# EAGLE schematic airu-board (EAGLE 7.6.0)

## Sheet 1 of 3
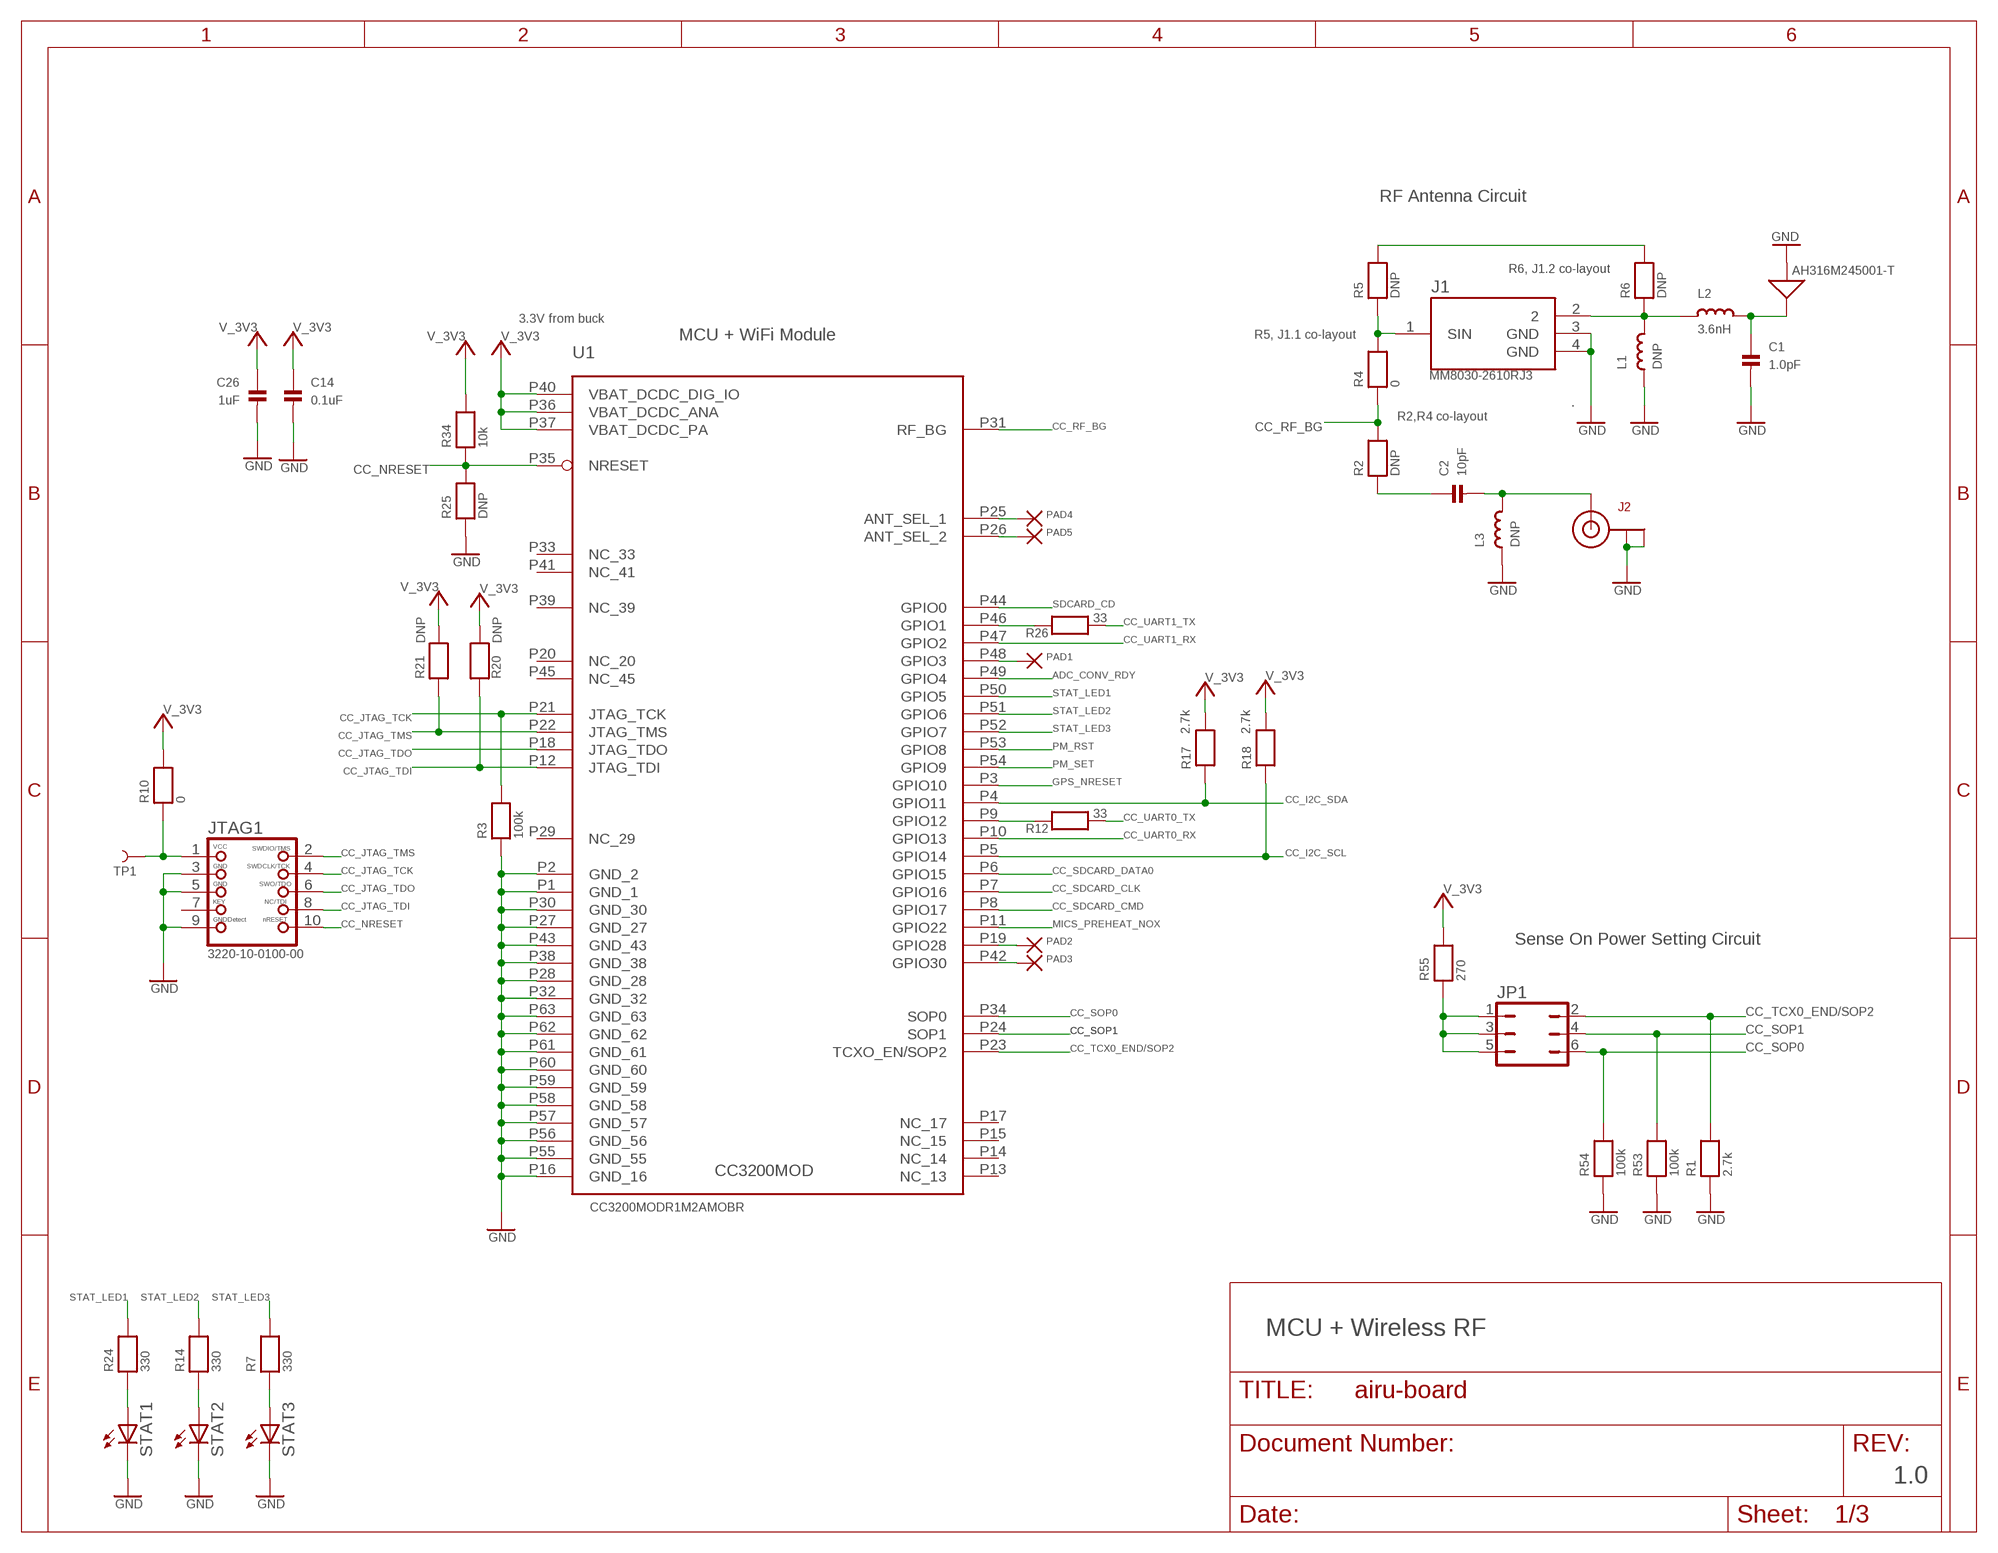
[diagram p0: schematic, sheet 1]

### Parts
C1  1.0pF  CAP_CERAMIC0402  [0402]
C2  10pF  CAP_CERAMIC0402  [0402]
C14  0.1uF  CAP_CERAMIC0402  [0402]
C26  1uF  CAP_CERAMIC0402  [0402]
E1  AH316M245001-T  [AH316M]
J1  MM8030-2610RJ3  [MURATA_MM8030-2610RJ3]
J2  U.FL-R-SMT-1(10)  U.FL  [U.FL]
JP1  JP3Q  [JP3Q]
JTAG1  3220-10-0100-00  JTAG-CORTEXM3MOLEX  [CORTEXM3_SWD10_MOLEX]
L1  DNP  INDUCTOR_0402  [_0402]
L2  3.6nH  INDUCTOR_0402  [_0402]
L3  DNP  INDUCTOR_0402  [_0402]
PAD1  2,54/1,0  [2,54/1,0]
PAD2  2,54/1,0  [2,54/1,0]
PAD3  2,54/1,0  [2,54/1,0]
PAD4  2,54/1,0  [2,54/1,0]
PAD5  2,54/1,0  [2,54/1,0]
R1  2.7k  RESISTOR0402  [0402]
R2  DNP  RESISTOR0402  [0402]
R3  100k  RESISTOR0402  [0402]
R4  0  RESISTOR0402  [0402]
R5  DNP  RESISTOR0402  [0402]
R6  DNP  RESISTOR0402  [0402]
R7  330  RESISTOR0402  [0402]
R10  0  RESISTOR0402  [0402]
R12  33  RESISTOR0402  [0402]
R14  330  RESISTOR0402  [0402]
R17  2.7k  RESISTOR0402  [0402]
R18  2.7k  RESISTOR0402  [0402]
R20  DNP  RESISTOR0402  [0402]
R21  DNP  RESISTOR0402  [0402]
R24  330  RESISTOR0402  [0402]
R25  DNP  RESISTOR0402  [0402]
R26  33  RESISTOR0402  [0402]
R34  10k  RESISTOR0402  [0402]
R53  100k  RESISTOR0402  [0402]
R54  100k  RESISTOR0402  [0402]
R55  270  RESISTOR0402  [0402]
STAT1  LEDCHIPLED_0603  [CHIPLED_0603]
STAT2  LEDCHIPLED_0603  [CHIPLED_0603]
STAT3  LEDCHIPLED_0603  [CHIPLED_0603]
TP1  TEST-POINT2  [PAD.02X.02]
U1  CC3200MODR1M2AMOBR  CC3200MOD  [CC3200MOD]

### Nets
ADC_CONV_RDY: U1.P49(GPIO4) ; also sheet 2
CC_I2C_SCL: R18.1 U1.P5(GPIO14) ; also sheet 2
CC_I2C_SDA: R17.1 U1.P4(GPIO11) ; also sheet 2
CC_JTAG_TCK: JTAG1.4 R3.2 U1.P21(JTAG_TCK)
CC_JTAG_TDI: JTAG1.8 R20.1 U1.P12(JTAG_TDI)
CC_JTAG_TDO: JTAG1.6 U1.P18(JTAG_TDO)
CC_JTAG_TMS: JTAG1.2 R21.1 U1.P22(JTAG_TMS)
CC_NRESET: JTAG1.10 R25.2 R34.1 U1.P35(NRESET) ; also sheet 3
CC_RF_BG: R2.2 R4.1 U1.P31(RF_BG)
CC_SDCARD_CLK: U1.P7(GPIO16) ; also sheet 2
CC_SDCARD_CMD: U1.P8(GPIO17) ; also sheet 2
CC_SDCARD_DATA0: U1.P6(GPIO15) ; also sheet 2
CC_SOP0: JP1.6 R54.2 U1.P34(SOP0)
CC_SOP1: JP1.4 R53.2 U1.P24(SOP1)
CC_TCX0_END/SOP2: JP1.2 R1.2 U1.P23(TCXO_EN/SOP2)
CC_UART0_RX: U1.P10(GPIO13) ; also sheet 2
CC_UART0_TX: R12.2 ; also sheet 2
CC_UART1_RX: U1.P47(GPIO2) ; also sheet 2
CC_UART1_TX: R26.2 ; also sheet 2
GND: C1.2 C14.2 C26.2 E1.P$2 J1.3(GND) J1.4(GND) J2.1(GND) J2.2(GND) JTAG1.3 JTAG1.5 JTAG1.9 L1.1 L3.1 R1.1 R3.1 R25.1 R53.1 R54.1 STAT1.C STAT2.C STAT3.C U1.P1(GND_1) U1.P2(GND_2) U1.P16(GND_16) U1.P27(GND_27) U1.P28(GND_28) U1.P30(GND_30) U1.P32(GND_32) U1.P38(GND_38) U1.P43(GND_43) U1.P55(GND_55) U1.P56(GND_56) U1.P57(GND_57) U1.P58(GND_58) U1.P59(GND_59) U1.P60(GND_60) U1.P61(GND_61) U1.P62(GND_62) U1.P63(GND_63) ; also sheet 2,3
GPS_NRESET: U1.P3(GPIO10) ; also sheet 2
MICS_PREHEAT_NOX: U1.P11(GPIO22) ; also sheet 2
N$1: J1.1(SIN) R4.2 R5.1
N$2: R5.2 R6.2
N$3: J1.2 L1.2 L2.1 R6.1
N$4: C1.1 E1.P$1 L2.2
N$7: C2.1 R2.1
N$8: C2.2 J2.3(SIGNAL) L3.2
N$15: JTAG1.1 R10.1 TP1.P$1
N$20: R12.1 U1.P9(GPIO12)
N$22: R26.1 U1.P46(GPIO1)
N$26: R24.1 STAT1.A
N$27: R14.1 STAT2.A
N$28: R7.1 STAT3.A
N$29: PAD1.1(P) U1.P48(GPIO3)
N$33: PAD2.1(P) U1.P19(GPIO28)
N$34: PAD3.1(P) U1.P42(GPIO30)
N$35: PAD4.1(P) U1.P25(ANT_SEL_1)
N$36: PAD5.1(P) U1.P26(ANT_SEL_2)
N$48: JP1.1 JP1.3 JP1.5 R55.1
PM_RST: U1.P53(GPIO8) ; also sheet 2
PM_SET: U1.P54(GPIO9) ; also sheet 2
SDCARD_CD: U1.P44(GPIO0) ; also sheet 2
STAT_LED1: R24.2 U1.P50(GPIO5)
STAT_LED2: R14.2 U1.P51(GPIO6)
STAT_LED3: R7.2 U1.P52(GPIO7)
V_3V3: C14.1 C26.1 R10.2 R17.2 R18.2 R20.2 R21.2 R34.2 R55.2 U1.P36(VBAT_DCDC_ANA) U1.P37(VBAT_DCDC_PA) U1.P40(VBAT_DCDC_DIG_IO) ; supply symbol labelled VCC ; also sheet 2,3
Unconnected: JTAG1.7 U1.P13(NC_13) U1.P14(NC_14) U1.P15(NC_15) U1.P17(NC_17) U1.P20(NC_20) U1.P29(NC_29) U1.P33(NC_33) U1.P39(NC_39) U1.P41(NC_41) U1.P45(NC_45)

### Notes on the sheet
- RF Antenna Circuit
- R6, J1.2 co-layout
- 3.3V from buck
- R5, J1.1 co-layout
- MCU + WiFi Module
- R2,R4 co-layout
- Sense On Power Setting Circuit
- MCU + Wireless RF
- 1.0

## Sheet 2 of 3
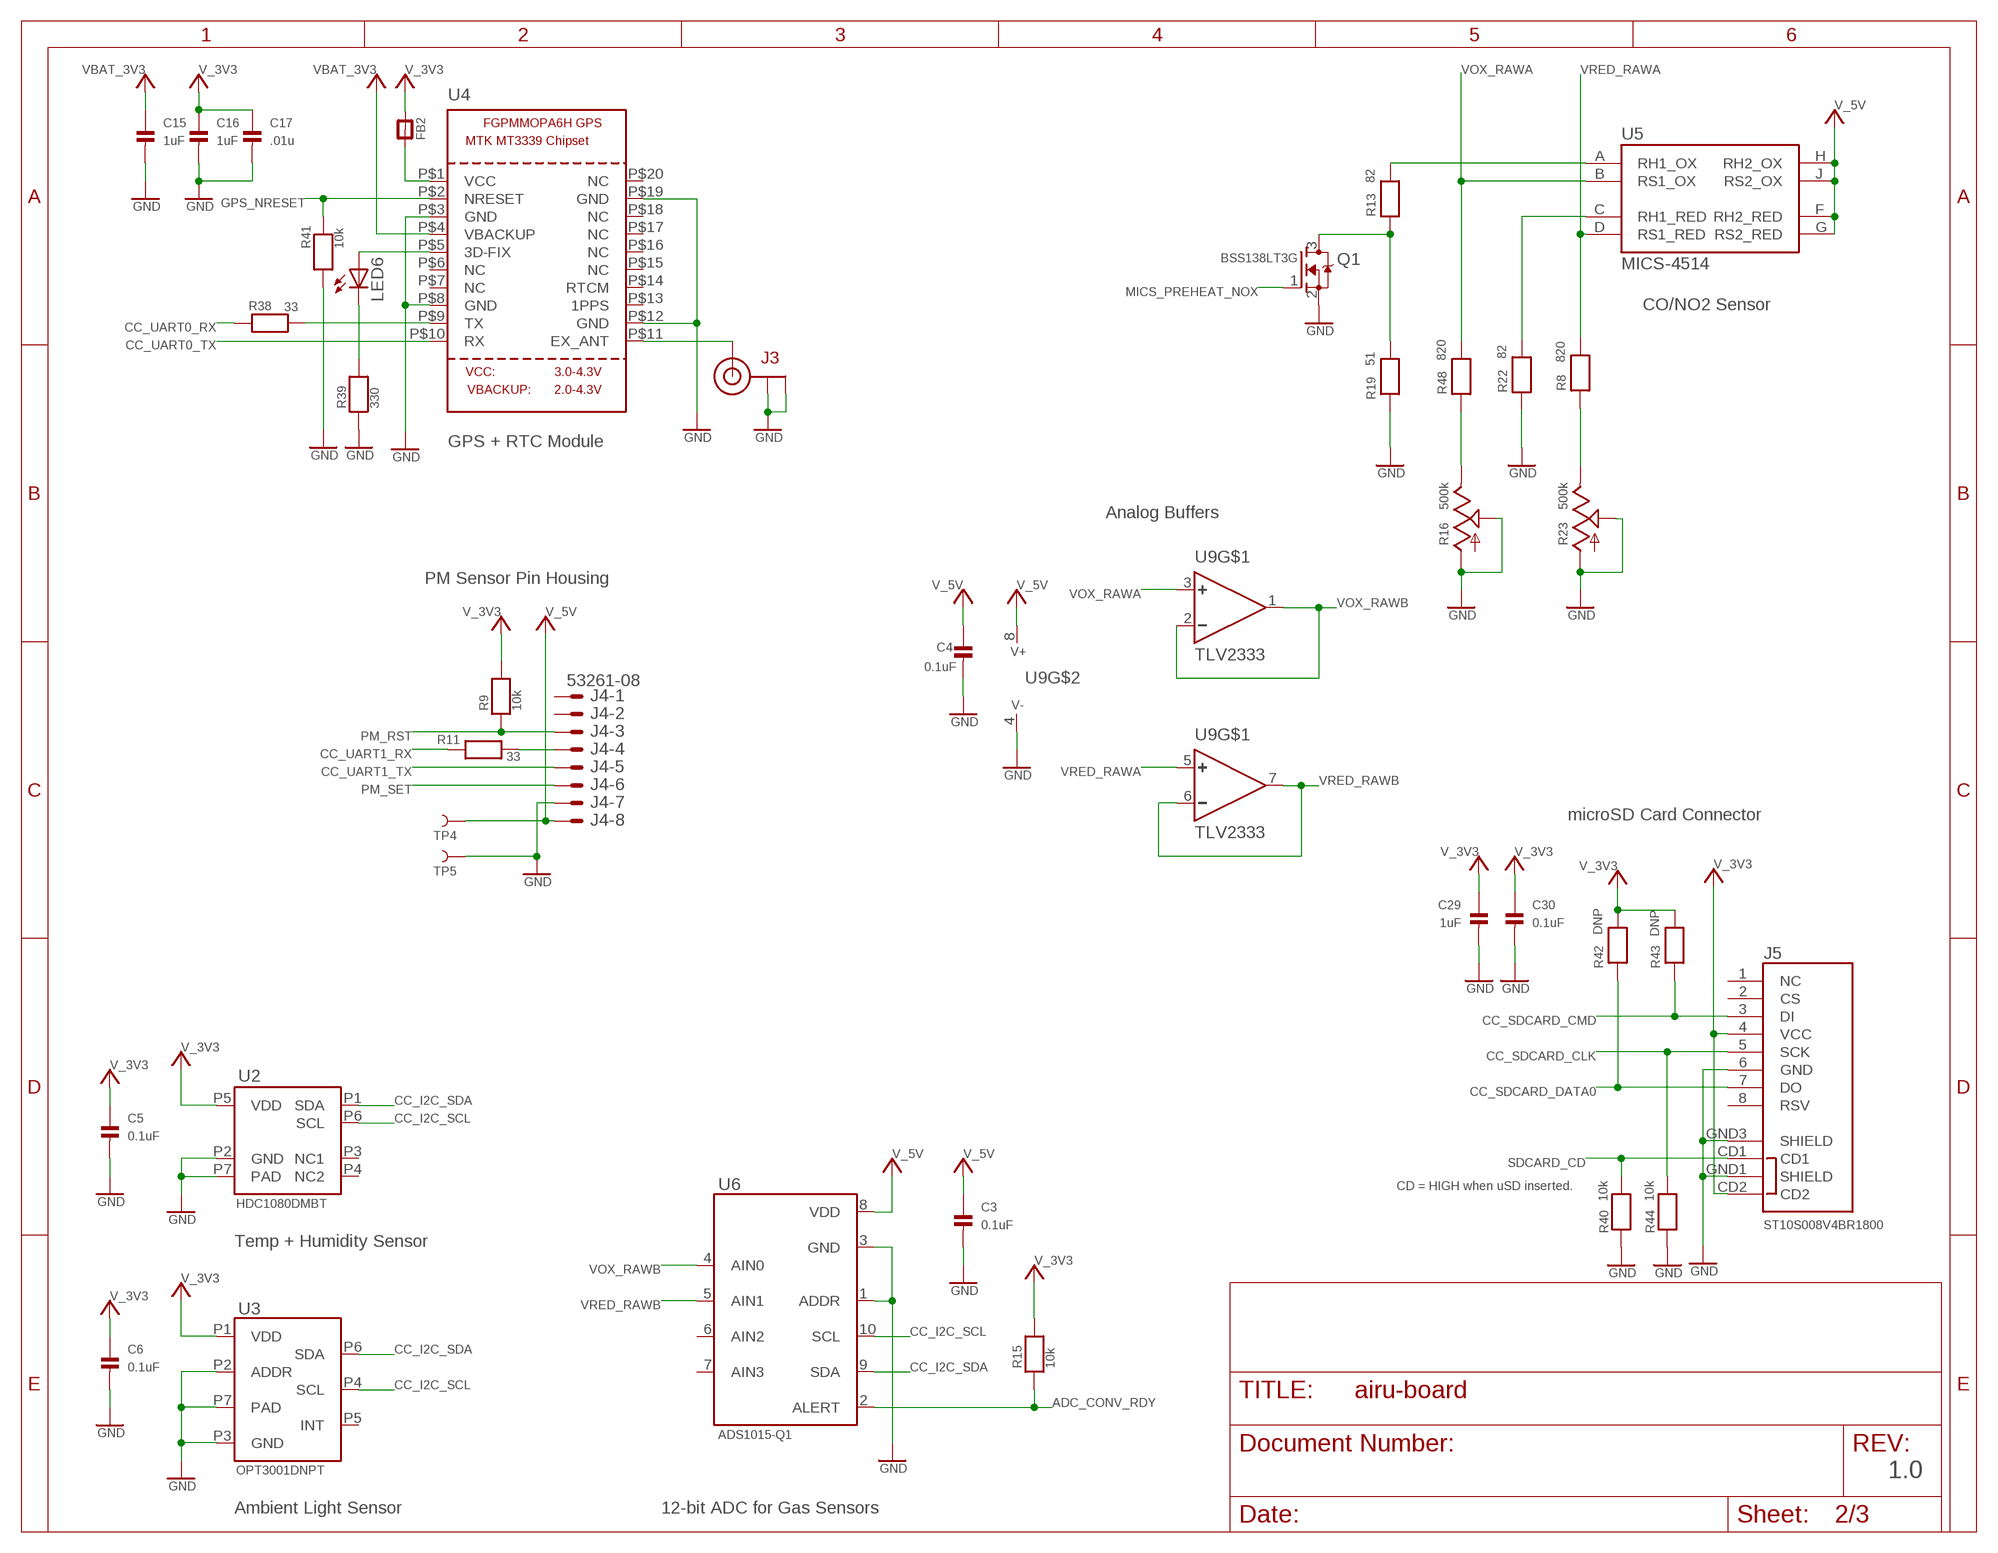
[diagram p1: schematic, sheet 2]

### Parts
C3  0.1uF  CAP_CERAMIC_0402  [_0402]
C4  0.1uF  CAP_CERAMIC_0402  [_0402]
C5  0.1uF  CAP_CERAMIC_0402  [_0402]
C6  0.1uF  CAP_CERAMIC_0402  [_0402]
C15  1uF  CAP_CERAMIC_0402  [_0402]
C16  1uF  CAP_CERAMIC_0402  [_0402]
C17  .01u  CAP_CERAMIC_0402  [_0402]
C29  1uF  CAP_CERAMIC_0402  [_0402]
C30  0.1uF  CAP_CERAMIC_0402  [_0402]
FB2  FERRITE_0402  [_0402]
J3  U.FL-R-SMT-1(10)  U.FL  [U.FL]
J4  53261-08  [53261-08]
J5  ST10S008V4BR1800  USD-SOCKET  [MICROSD_1:1]
LED6  LEDCHIPLED_0603  [CHIPLED_0603]
Q1  BSS138LT3G  MOSFET-NREFLOW  [SOT23]
R8  820  RESISTOR0402  [0402]
R9  10k  RESISTOR0402  [0402]
R11  33  RESISTOR0402  [0402]
R13  82  RESISTOR0402  [0402]
R15  10k  RESISTOR0402  [0402]
R16  500k  TRIM_US-B25P  [B25P]
R19  51  RESISTOR0402  [0402]
R22  82  RESISTOR0402  [0402]
R23  500k  TRIM_US-B25P  [B25P]
R38  33  RESISTOR0402  [0402]
R39  330  RESISTOR0402  [0402]
R40  10k  RESISTOR0402  [0402]
R41  10k  RESISTOR0402  [0402]
R42  DNP  RESISTOR0402  [0402]
R43  DNP  RESISTOR0402  [0402]
R44  10k  RESISTOR0402  [0402]
R48  820  RESISTOR0402  [0402]
TP4  TEST-POINT2  [PAD.02X.02]
TP5  TEST-POINT2  [PAD.02X.02]
U2  HDC1080DMBT  HDC1080  [WSON]
U3  OPT3001DNPT  OPT3001  [USON]
U4  GPS_FGPMMOPA6H  [FGPMMOPA6H]
U5  MICS-4514  [MICS_10-SMD]
U6  ADS1015-Q1  ADS1015  [S-PDSO-G10]
U9  TLV2333  [DGK_S-PDSO-G8]

### Nets
ADC_CONV_RDY: R15.1 U6.2(ALERT) ; also sheet 1
CC_I2C_SCL: U2.P6(SCL) U3.P4(SCL) U6.10(SCL) ; also sheet 1
CC_I2C_SDA: U2.P1(SDA) U3.P6(SDA) U6.9(SDA) ; also sheet 1
CC_SDCARD_CLK: J5.5(SCK) R44.2 ; also sheet 1
CC_SDCARD_CMD: J5.3(DI) R43.1 ; also sheet 1
CC_SDCARD_DATA0: J5.7(DO) R42.1 ; also sheet 1
CC_UART0_RX: R38.1 ; also sheet 1
CC_UART0_TX: U4.P$10(RX) ; also sheet 1
CC_UART1_RX: R11.1 ; also sheet 1
CC_UART1_TX: J4.5 ; also sheet 1
GND: C3.2 C4.2 C5.2 C6.2 C15.2 C16.2 C17.2 C29.2 C30.2 J3.1(GND) J3.2(GND) J4.7 J5.6(GND) J5.GND1(SHIELD) J5.GND3(SHIELD) Q1.2(S) R16.A R16.S R19.1 R22.1 R23.A R23.S R39.1 R40.1 R41.1 R44.1 TP5.P$1 U2.P2(GND) U2.P7(PAD) U3.P2(ADDR) U3.P3(GND) U3.P7(PAD) U4.P$3(GND) U4.P$8(GND) U4.P$12(GND) U4.P$19(GND) U6.1(ADDR) U6.3(GND) U9.4(V-) ; also sheet 1,3
GPS_NRESET: R41.2 U4.P$2(NRESET) ; also sheet 1
MICS_PREHEAT_NOX: Q1.1(G) ; also sheet 1
N$11: J4.4 R11.2
N$13: R13.2 U5.A(RH1_OX)
N$14: Q1.3(D) R13.1 R19.2
N$19: R22.2 U5.C(RH1_RED)
N$21: R16.E R48.1
N$24: R8.1 R23.E
N$30: J3.3(SIGNAL) U4.P$11(EX_ANT)
N$31: LED6.A U4.P$5(3D-FIX)
N$32: LED6.C R39.2
N$44: R38.2 U4.P$9(TX)
PM_RST: J4.3 R9.1 ; also sheet 1
PM_SET: J4.6 ; also sheet 1
SDCARD_CD: J5.CD1 R40.2 ; also sheet 1
V_3V3: C5.1 C6.1 C16.1 C17.1 C29.1 C30.1 FB2.1 FB2.2 J5.4(VCC) J5.CD2 R9.2 R15.2 R42.2 R43.2 U2.P5(VDD) U3.P1(VDD) U4.P$1(VCC) ; supply symbol labelled VCC ; also sheet 1,3
V_5V: C3.1 C4.1 J4.8 TP4.P$1 U5.F(RH2_RED) U5.G(RS2_RED) U5.H(RH2_OX) U5.J(RS2_OX) U6.8(VDD) U9.8(V+) ; supply symbol labelled VCC ; also sheet 3
VBAT_3V3: C15.1 U4.P$4(VBACKUP) ; supply symbol labelled VCC ; also sheet 3
VOX_RAWA: R48.2 U5.B(RS1_OX) U9.3(+)
VOX_RAWB: U6.4(AIN0) U9.1(OUT) U9.2(-)
VRED_RAWA: R8.2 U5.D(RS1_RED) U9.5(+1)
VRED_RAWB: U6.5(AIN1) U9.6(-1) U9.7(OUT1)
Unconnected: J4.1 J4.2 J5.1(NC) J5.2(CS) J5.8(RSV) U2.P3(NC1) U2.P4(NC2) U3.P5(INT) U4.P$6(NC) U4.P$7(NC) U4.P$13(1PPS) U4.P$14(RTCM) U4.P$15(NC) U4.P$16(NC) U4.P$17(NC) U4.P$18(NC) U4.P$20(NC) U6.6(AIN2) U6.7(AIN3)

### Notes on the sheet
- CO/NO2 Sensor
- GPS + RTC Module
- Analog Buffers
- PM Sensor Pin Housing
- microSD Card Connector
- CD = HIGH when uSD inserted.
- Temp + Humidity Sensor
- 1.0
- Ambient Light Sensor | 12-bit ADC for Gas Sensors

## Sheet 3 of 3
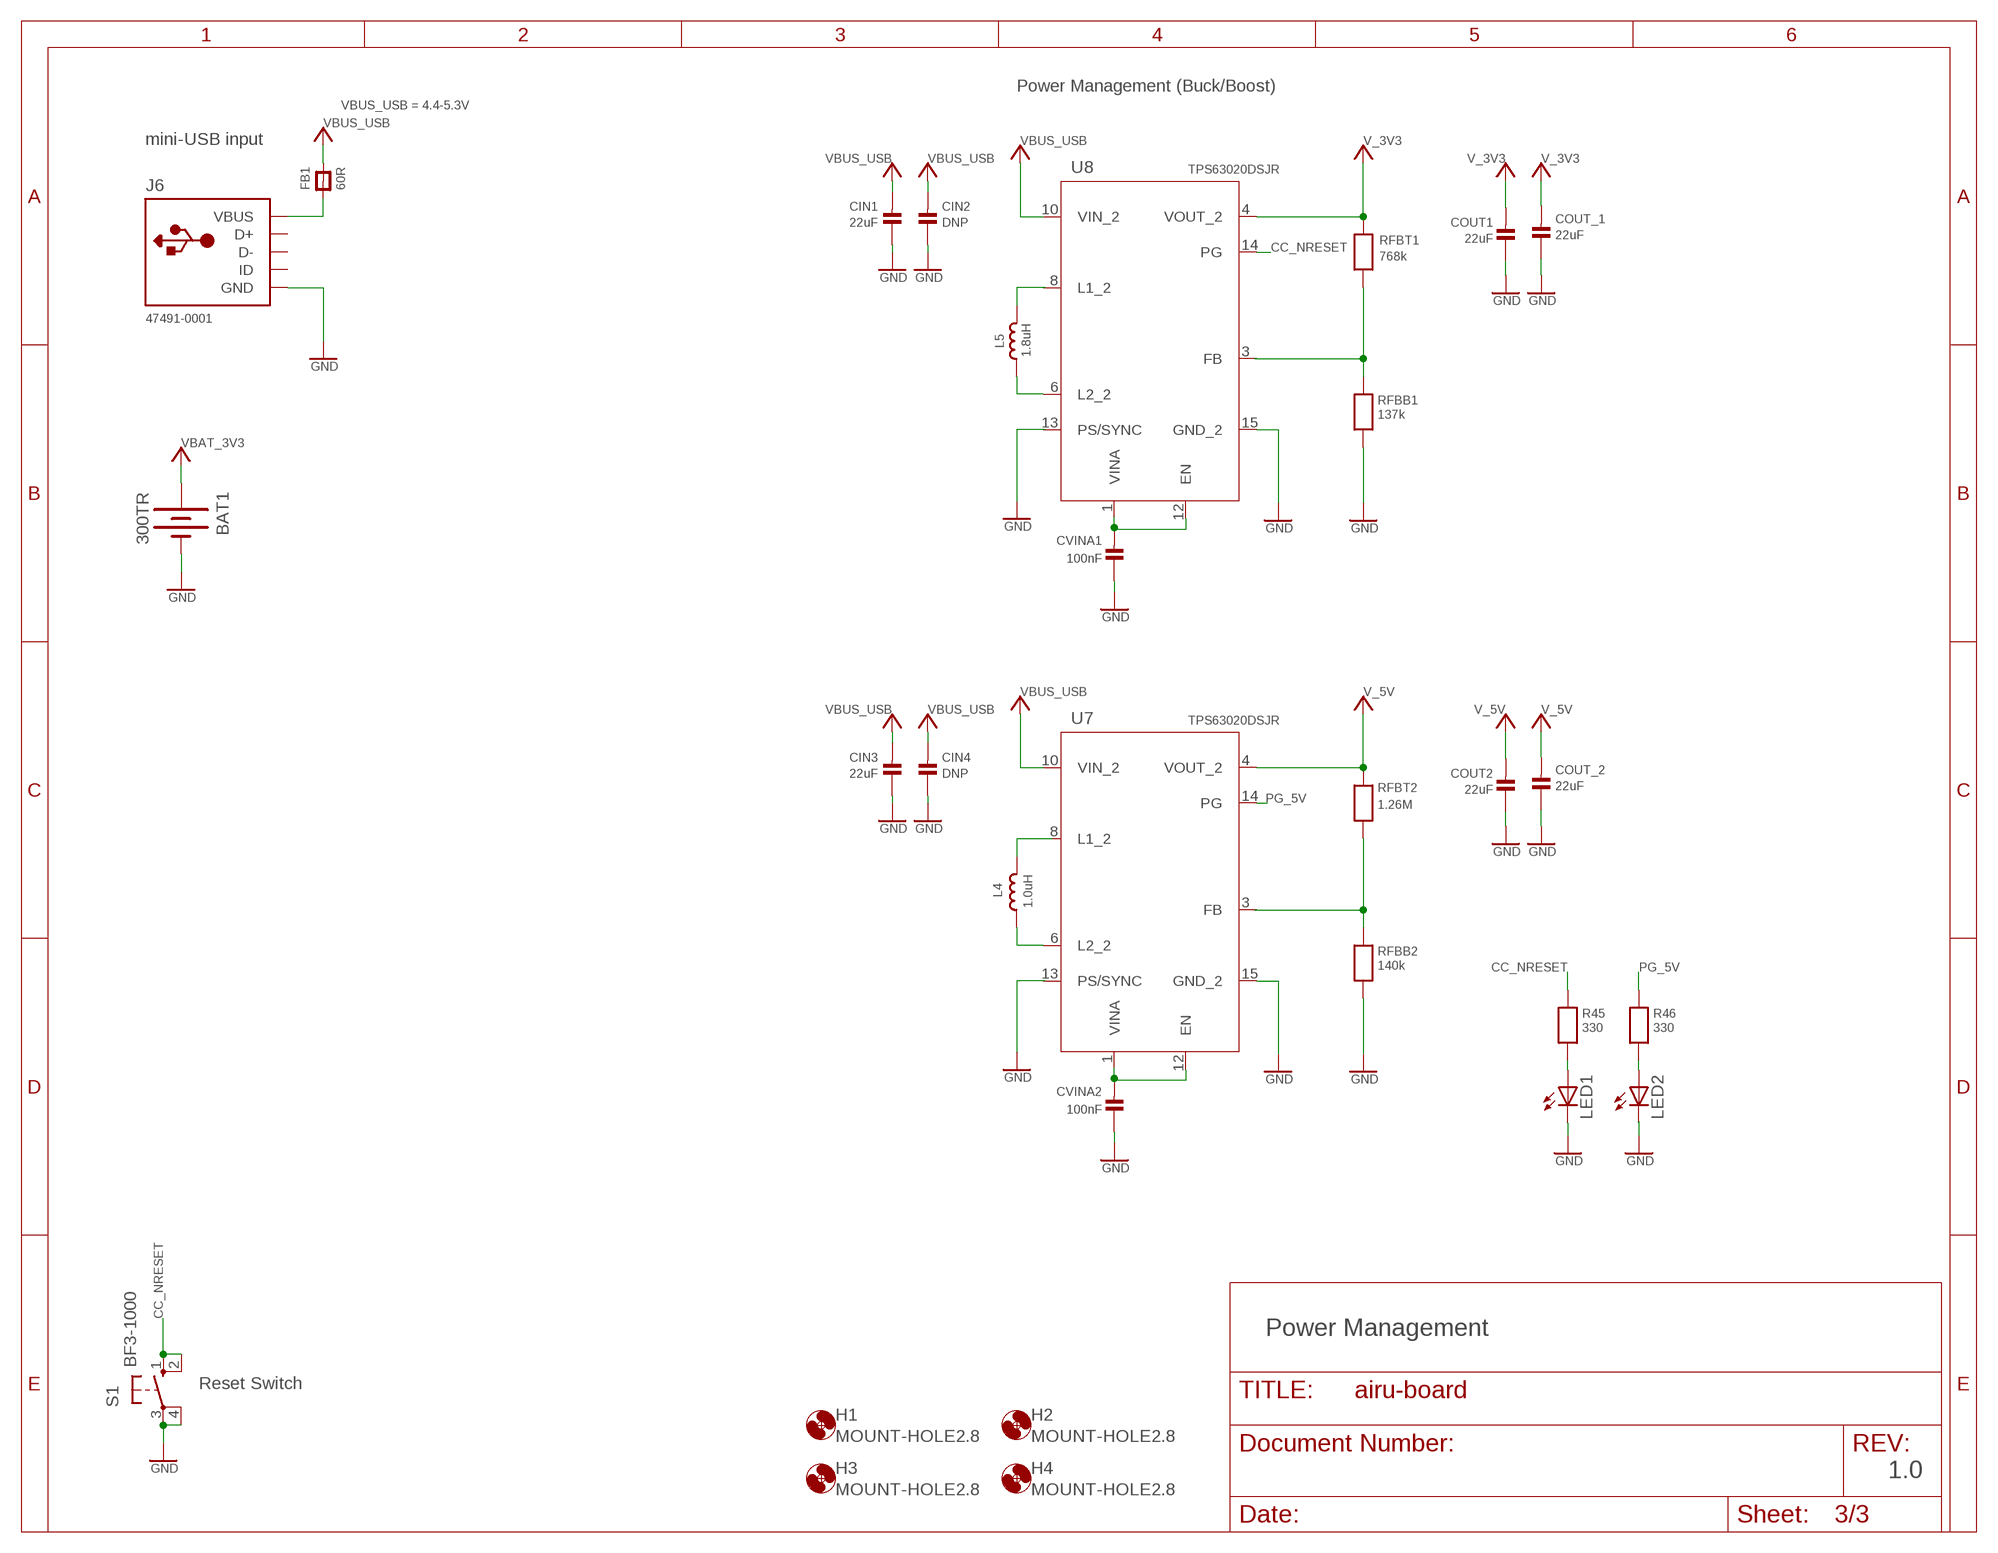
[diagram p2: schematic, sheet 3]

### Parts
BAT1  300TR  BATTERY12MM  [BATTCON_12MM]
CIN1  22uF  GRM31CR61A226KE19L  [1206_190]
CIN2  DNP  GRM31CR61A226KE19L  [1206_190]
CIN3  22uF  GRM31CR61A226KE19L  [1206_190]
CIN4  DNP  GRM31CR61A226KE19L  [1206_190]
COUT1  22uF  GRM21BR60J226ME39L  [0805]
COUT2  22uF  GRM21BR60J226ME39L  [0805]
COUT_1  22uF  GRM21BR60J226ME39L  [0805]
COUT_2  22uF  GRM21BR60J226ME39L  [0805]
CVINA1  100nF  C0603C104K8RACTU  [0603]
CVINA2  100nF  C0603C104K8RACTU  [0603]
FB1  60R  FERRITE_0402  [_0402]
H1  MOUNT-HOLE2.8  [2,8]
H2  MOUNT-HOLE2.8  [2,8]
H3  MOUNT-HOLE2.8  [2,8]
H4  MOUNT-HOLE2.8  [2,8]
J6  47491-0001  USBMINIB  [USB-MINIB]
L4  1.0uH  SRN3015-1R0Y  [SRN3015]
L5  1.8uH  SDR0403-1R8ML  [SDR0403]
LED1  LEDCHIPLED_0603  [CHIPLED_0603]
LED2  LEDCHIPLED_0603  [CHIPLED_0603]
R45  330  CRCW0402137KFKED  [0402]
R46  330  CRCW0402137KFKED  [0402]
RFBB1  137k  CRCW0402137KFKED  [0402]
RFBB2  140k  CRCW0402137KFKED  [0402]
RFBT1  768k  CRCW0402768KFKED  [0402]
RFBT2  1.26M  RT0805BRD071M26L  [0805]
S1  BF3-1000  10-XX  [B3F-10XX]
U7  TPS63020DSJR  [R-PVSON-N14]
U8  TPS63020DSJR  [R-PVSON-N14]

### Nets
CC_NRESET: R45.P1 S1.1(S) S1.2(S1) U8.14(PG) ; also sheet 1
GND: BAT1.GND(-) CIN1.2 CIN2.2 CIN3.2 CIN4.2 COUT1.2 COUT2.2 COUT_1.2 COUT_2.2 CVINA1.2 CVINA2.2 J6.GND LED1.C RFBB1.P2 RFBB2.P2 S1.3(P) S1.4(P1) U7.15(GND_2) U8.15(GND_2) ; also sheet 1,2
N$5: CVINA1.1 U8.12(EN)
N$6: L5.2
N$9: L5.1 U8.6(L2_2)
N$10: L4.1 U7.6(L2_2)
N$12: L4.2
N$16: RFBB1.P1 RFBT1.P2
N$17: RFBB2.P1 RFBT2.2
N$18: CVINA2.1 U7.12(EN)
N$23: LED2.A R46.P2
N$25: LED1.A R45.P2
N$39: FB1.1 J6.VBUS
PG_5V: R46.P1 U7.14(PG)
V_3V3: COUT1.1 COUT_1.1 RFBT1.P1 U8.4(VOUT_2) ; supply symbol labelled VCC ; also sheet 1,2
V_5V: COUT2.1 COUT_2.1 RFBT2.1 U7.4(VOUT_2) ; supply symbol labelled VCC ; also sheet 2
VBAT_3V3: BAT1.PWR@1(+) ; supply symbol labelled VCC ; also sheet 2
VBUS_USB: CIN1.1 CIN2.1 CIN3.1 CIN4.1 FB1.2 U7.10(VIN_2) U8.10(VIN_2) ; supply symbol labelled VCC
Unconnected: J6.D+ J6.D- J6.ID LED2.C U7.1(VINA) U7.3(FB) U7.8(L1_2) U7.13(PS/SYNC) U8.1(VINA) U8.3(FB) U8.8(L1_2) U8.13(PS/SYNC)

### Notes on the sheet
- Power Management (Buck/Boost)
- VBUS_USB = 4.4-5.3V
- mini-USB input
- Power Management
- Reset Switch
- 1.0

## Library data of the parts
BAT1 = airu-parts:BATTERY: Battery Holders Various common sizes : AA, AAA, 18650 (PRT-12895), 20mm coin cell and 12mm coin cell. 20MM_4LEGS, BATT-10373; MANUFACTURER_NAME: Keystone; MANUFACTURER_PART_NUMBER: 300TR; PROD_ID: BATT-08044
C1-C6 C14-C17 C26 C29 C30 = microbuilder:CAP_CERAMIC: Ceramic Capacitors 0402 - 0402 Surface Mount Capacitors 16pF 50V 5% [Digikey: 445-4899-2-ND] 18pF 50V 5% [Digikey: 490-1281-2-ND] 22pF 50V 5% [Digikey: 490-1283-2-ND] 68pF 50V 5% [Digikey: 490-1289-2-ND] 0.1uF 10V 10% [Digikey: 490-1318-2-ND] 1.0uF 6.3V 10% [Digikey: 490-1320-2-ND] 0603 - 0603 Surface Mount Capacitors 16 pF 50V 5% [Digikey: 445-5051-2-ND] 22 pF 50V [Digikey: PCC220ACVTR-ND] 33 pF 50V 5% [Digikey: 490-1415-1-ND] 56pF 50V 5% [Digikey: 490-1421-1-ND] 220pF 50V 5% [Digikey: 445-1285-1-ND] 680 pF 50V 2200 pF 50V 5% C0G [Digikey: 445-1297-1-ND] 5600 pF 100V 5% X7R [Digikey: 478-3711-1-ND] 0.1 µF 25V 10% [Digikey: PCC2277TR-ND] 0.22 µF 16V 10% X7R [Digikey: 445-1318-1-ND] 1.0 µF 25V 10% [Digikey: 445-5146-2-ND] 0603 - RF Specific 3pF 250V +/-0.1pF RF [Digikey: 712-1347-1-ND] 18 pF 250V 5% [Digikey: 478-3505-1-ND or 712-1322-1-ND] 56 pF 250V 5% C0G RF [Digikey: 490-4867-1-ND] 68 pF 250V RF [Digikey: 490-4868-1-ND] 0805 - 0805 Surface Mount Capacitors 220 pF 250V 2% RF Ceramic Capacitor [Digikey: 712-1398-1-ND] 1000 pF 50V 2% NP0 Ceramic Capacitor [Digikey: 478-3760-1-ND] 0.1 µF 25V 10% Ceramic Capacitor [Digikey: PCC1828TR-ND] 1.0 µF 16V 10% Ceramic Capacitor[Digikey: 490-1691-2-ND] 10.0 µF 10V 10% Ceramic Capacitor[Digikey: 709-1228-1-ND] 10.0 uF 16V 10% Ceramic Capacitor [Digikey: 478-5165-2-ND] 47 uF 6.3V 20% Ceramic Capacitor [Digikey: 587-1779-1-ND or 399-5506-1-ND] 1206 - 1206 Surface Mount Capacitors 47uF 10V 20% Ceramic Capacitor [Digikey: 490-5528-1-ND or 399-5508-1-ND or 445-6010-1-ND] 100uF 6.3V -20%, +80% Y5V Ceramic Capacitor (Digikey: 490-4512-1-ND, Mouser: 81-GRM31CF50J107ZE1L)
CIN1-CIN4 = AcceleratedDesigns_Lib:GRM31CR61A226KE19L; CAP: 2.2E-5; ESR: 0.0; IRMS: 0.0; MANUFACTURER_NAME: MuRata; MANUFACTURER_PART_NUMBER: GRM31CR61A226KE19L; VDC: 10.0; VENDOR: MuRata
COUT1 COUT2 COUT_1 COUT_2 = AcceleratedDesigns_Lib:GRM21BR60J226ME39L; CAP: 2.2E-5; ESR: 0.0; IRMS: 0.0; MANUFACTURER_NAME: MuRata; MANUFACTURER_PART_NUMBER: GRM21BR60J226ME39L; VDC: 6.3; VENDOR: MuRata
CVINA1 CVINA2 = AcceleratedDesigns_Lib:C0603C104K8RACTU; CAP: 1.0E-7; ESR: 0.0; IRMS: 0.0; MANUFACTURER_NAME: Kemet; MANUFACTURER_PART_NUMBER: C0603C104K8RACTU; VDC: 10.0; VENDOR: Kemet
E1 = yuden:AH316M245001-T: ANT BLUETOOTH W-LAN ZIGBEE WIMAX
FB1 FB2 = microbuilder:FERRITE: Ferrite Bead 0603 MMZ1608B121C - 120 Ohm @ 100MHz, 600mA, 0.15 Ohm DC Resistance - Digikey: 445-2164-1-ND BK1608HW121-T - 120 Ohm, 600mA Ferrite Chip - Digikey: 587-1876-2-ND 0805 HZ0805B272R-10 - 2.7K Ohm @ 100MHz, 200mA, 0.8 Ohm DC Resistance - Digikey: 240-2504-1-ND (see also Murata BLM21BD272SN1L) MMZ2012Y152B - 1.5K Ohm @ 100MHz, 500mA, 0.4 Ohm DC Resistance - Digikey: 445-1560-1-ND - Mainly for high frequency (80-400MHz) MMZ2012R102A - 1K Ohm @ 100MHz, 500mA, 0.3 Ohm DC Resistance - Digikey: 445-1555-2-ND - More general purpose (10-200MHz)
H1-H4 = holes:MOUNT-HOLE: MOUNTING HOLE with drill center marker
J1 = MM8030-2610RJ3:MM8030-2610RJ3: Conn Coaxial RCP 0Hz to 11GHz 50Ohm Solder ST SMD Gold Reel
J2 J3 = microbuilder:U.FL: U.FL Antenna Connector
J4 = con-molex:53?-08: CONNECTOR wire to board 1.25 mm (.049 inch) pitch header; OC_FARNELL: 1125376; OC_NEWARK: unknown
J5 = SparkFun-Connectors:USD-SOCKET: microSD Socket Push-push type uSD socket. Schematic element and footprint production proven. Spark Fun Electronics SKU : PRT-00127. tDoc lines correctly indicate media card edge positions when inserting (unlocked, locked, depressed). NOTE: CD1 and CD2 are connected internally; MANUFACTURER_NAME: JAE; MANUFACTURER_PART_NUMBER: ST10S008V4BR1800; PROD_ID: CONN-07820
J6 = airu-parts:USB: USB Connectors USBMINIB - Surface Mount Female Mini-B USB Connector 4UConnector: 06564 By microbuilder.eu Thru-hole RA Female Mini-B USB Connector 4UConnector: 18732 By ladyada.net; MANUFACTURER_NAME: Molex; MANUFACTURER_PART_NUMBER: 47491-0001
JP1 = jumper:JP3Q: JUMPER
JTAG1 = microbuilder:JTAG-CORTEXM3: Serial Wire (SW-DP) Connector This standard 0.05" 10-pin connector is for use with the Cortex M0/M3's native SWD (serial wire debugger) interface (SW-DP). Some boards support a 20-pin combined JTAG+SWD connector (SWJ-DP), such as the LPC1700 family, but many smaller devices only work with SWD which typically use the smaller 10-pin SW-DP connecter (the LPC1300 family, for example, only supports SWD). 2x05 1.27mm/0.05" Connector: This is the standard SMT connector defined by ARM for all Cortex devices, and should be used in most situations and for forward-compatibility since any new devices coming to market will likely use this connector. MOLEX 10 Pin 0.1" Connector: This 0.1" 10 pin connector has the same pin layout as the standard 0.05" connector, but is easier to work with if you are using standard jumper wires or custom cables to connect your SWD hardware. MOLEX 20 Pin 0.1" Connector: This 0.1" 20 pin connector is the same model used for ARM7/ARM9 JTAG debuggers, but is connected to match the pins on the Segger J-Link for ARM (which supports both JTAG and SWD debugging). See the following document from ARM for more information on Cortex M3 Debug Connectors: http://infocenter.arm.com/help/topic/com.arm.doc.faqs/attached/13634/cortex_debug_connectors.pdf And the following page for an overview with images of the different connector types: http://www.keil.com/peripherals/coresight/connectors.asp; MANUFACTURER_NAME: CNC Tech; MANUFACTURER_PART_NUMBER: 3220-10-0100-00
L1-L3 = microbuilder:INDUCTOR: Inductors 0603: 10nH Ceramic Inductor - microwire antenna/RF (Digikey: 712-1434-2-ND) 0805: 560nH Ceramic Inductor - RF (Digikey: 553-1047-1-ND) 270nH Ceramic Inductor - Q = 40@250MHz, +-5%, 1 Ohm DC Resistance (Digikey: 535-10506-2-ND) 1007 (2518 Metric) SMT: 10µH 10% 250mOhm 820mA 1007 Inductor (Digikey: 587-2189-1-ND) 22µH 10% 500mOhm 580mA 1007 Inductor (Digikey: 587-2190-1-ND) 47µH 10% 950mOhm 420mA 1007 Inductor (Digikey: 587-2191-1-ND) 47µH 5% 100mOhm 1A 1008 Inductor (Digikey: 732-1816-1-ND) 5.0x5.0mm (Taiyo Yuden NR5040 Series) 6.8µH 20% 2.3A 64mOhm Inductor (Digikey: 587-2374-2-ND) 5.0x5.0mm (TDK VLC5045 Series) 4.7µH 20% 3.3A 34mOhm Inductor (Digikey: 445-6526-1-ND) 6.8µH 20% 2.7A 46mOhm Inductor (Digikey: 445-6527-1-ND) 6.0x6.0mm (TDK VLC6045 Series) 4.7µH 20% 3.8A 27mOhm Inductor (Digikey: 445-6538-2-ND) 6.8µH 20% 3A 41mOhm Inductor (Digikey: 445-6540-1-ND) 6.2µH 30% 2.2A 45mOhm Inductor (Digikey: SRR5028-6R2YCT-ND) - Not TDK VLC6045 but footprint should match 6.0x6.0mm (TDK SLF6045 Series) 6.8uH 30% 2A 33mOhm Inductor (Digikey: 445-4572-1-ND, Mouser: 810-SLF645T6R8N2R0PF)
L4 = AcceleratedDesigns_Lib:SRN3015-1R0Y; DATASHEETURL: http://www.bourns.com/data/global/pdfs/SRN3015.pdf; DCR: 0.048; IDC: 2.35; L: 1.0E-6; MANUFACTURER_NAME: Bourns; MANUFACTURER_PART_NUMBER: SRN3015-1R0Y; VENDOR: Bourns
L5 = AcceleratedDesigns_Lib:SDR0403-1R8ML; DCR: 0.042; IDC: 2.91; L: 1.8E-6; MANUFACTURER_NAME: Bourns; MANUFACTURER_PART_NUMBER: SDR0403-1R8ML; VENDOR: Bourns
LED1 LED2 LED6 STAT1-STAT3 = led:LED: LED OSRAM: - CHIPLED LG R971, LG N971, LY N971, LG Q971, LY Q971, LO R971, LY R971 LH N974, LH R974 LS Q976, LO Q976, LY Q976 LO Q996 - Hyper CHIPLED LW Q18S LB Q993, LB Q99A, LB R99A - SideLED LS A670, LO A670, LY A670, LG A670, LP A670 LB A673, LV A673, LT A673, LW A673 LH A674 LY A675 LS A676, LA A676, LO A676, LY A676, LW A676 LS A679, LY A679, LG A679 - Hyper Micro SIDELED® LS Y876, LA Y876, LO Y876, LY Y876 LT Y87S - SmartLED LW L88C, LW L88S LB L89C, LB L89S, LG L890 LS L89K, LO L89K, LY L89K LS L896, LA L896, LO L896, LY L896 - TOPLED LS T670, LO T670, LY T670, LG T670, LP T670 LSG T670, LSP T670, LSY T670, LOP T670, LYG T670 LG T671, LOG T671, LSG T671 LB T673, LV T673, LT T673, LW T673 LH T674 LS T676, LA T676, LO T676, LY T676, LB T676, LH T676, LSB T676, LW T676 LB T67C, LV T67C, LT T67C, LS T67K, LO T67K, LY T67K, LW E67C LS E67B, LA E67B, LO E67B, LY E67B, LB E67C, LV E67C, LT E67C LW T67C LS T679, LY T679, LG T679 LS T770, LO T770, LY T770, LG T770, LP T770 LB T773, LV T773, LT T773, LW T773 LH T774 LS E675, LA E675, LY E675, LS T675 LS T776, LA T776, LO T776, LY T776, LB T776 LHGB T686 LT T68C, LB T68C - Hyper Mini TOPLED® LB M676 - Mini TOPLED Santana® LG M470 LS M47K, LO M47K, LY M47K Source: http://www.osram.convergy.de LUXEON: - LUMILED® LXK2-PW12-R00, LXK2-PW12-S00, LXK2-PW14-U00, LXK2-PW14-V00 LXK2-PM12-R00, LXK2-PM12-S00, LXK2-PM14-U00 LXK2-PE12-Q00, LXK2-PE12-R00, LXK2-PE12-S00, LXK2-PE14-T00, LXK2-PE14-U00 LXK2-PB12-K00, LXK2-PB12-L00, LXK2-PB12-M00, LXK2-PB14-N00, LXK2-PB14-P00, LXK2-PB14-Q00 LXK2-PR12-L00, LXK2-PR12-M00, LXK2-PR14-Q00, LXK2-PR14-R00 LXK2-PD12-Q00, LXK2-PD12-R00, LXK2-PD12-S00 LXK2-PH12-R00, LXK2-PH12-S00 LXK2-PL12-P00, LXK2-PL12-Q00, LXK2-PL12-R00 Source: www.luxeon.com KINGBRIGHT: KA-3528ASYC Source: www.kingbright.com
PAD1-PAD5 = wirepad:2,54/1,0: THROUGH-HOLE PAD
Q1 = adafruit:MOSFET-N: N-Channel Mosfet 2N7002E - 60V 260mA SOT23 [Digikey: 2N7002ET1GOSTR-ND] - REEL BSH103 - 30V 850mA SOT23 [Digikey: 568-5013-1-ND]
R1-R15 R17-R22 R24-R26 R34 R38-R44 R48 R53-R55 = microbuilder:RESISTOR: Resistors 0402 - 0402 Surface Mount Package 22 Ohm 1% 1/16W [Digikey: 311-22.0LRTR-ND] 33 Ohm 5% 1/16W 1.0K 5% 1/16W 1.5K 5% 1/16W 2.0K 1% 1/16W 10.0K 1% 1/16W [Digikey: 311-10.0KLRTR-ND] 10.0K 5% 1/16W [Digikey: RMCF0402JT10K0TR-ND] 12.1K 1% 1/16W [Digikey: 311-22.0LRTR-ND] 100.0K 5% 1/16W 0603 - 0603 Surface Mount Package 0 Ohm 1/10 Watt 1% Resistor 15 Ohm 1/10 Watt 1% Resistor 33 Ohm 1/10 Watt 1% Resistor 49.9 Ohm 1/10 Watt 1% Resistor 100 Ohm 1/10 Watt 1% Resistor 150 Ohm 1/10 Watt 1% Resistor 240 Ohm 1/10 Watt 1% Resistor 390 Ohm 1/10 Watt 1% Resistor 560 Ohm 1/10 Watt 1% Resistor 680 Ohm 1/10 Watt 1% Resistor 750 Ohm 1/10 Watt 1% Resistor 1.0K Ohm 1/10 Watt 1% Resistor 1.5K Ohm 1/10 Watt 1% Resistor 2.0K Ohm 1/10 Watt 1% Resistor 2.2K Ohm 1/10 Watt 1% Resistor 3.3K Ohm 1/10 Watt 1% Resistor 4.7K Ohm 1/10 Watt 1% Resistor 10.0K Ohm 1/10 Watt 1% Resistor 12.0K Ohm 1/10 Watt 1% Resistor 12.1K Ohm 1/10 Watt 1% Resistor 20.0K Ohm 1/10 Watt 1% Resistor 33.0K Ohm 1/10 Watt 1% Resistor 100.0K Ohm 1/10 Watt 1% Resistor 0805 - 0805 Surface Mount Package 0 Ohm 1/8 Watt 1% Resistor 33 Ohm 1/8 Watt 1% Resistor 100 Ohm 1/8 Watt 1% Resistor 150 Ohm 1/8 Watt 1% Resistor 200 Ohm 1/8 Watt 1% Resistor 240 Ohm 1/8 Watt 1% Resistor 330 Ohm 1/8 Watt 1% Resistor 390 Ohm 1/8 Watt 1% Resistor 470 Ohm 1/8 Watt 1% Resistor 1.0K Ohm 1/8 Watt 1% Resistor 1.5K Ohm 1/8 Watt 1% Resistor 2.0K Ohm 1/8 Watt 1% Resistor 4.7K Ohm 1/8 Watt 1% Resistor 5.1K Ohm 1/8 Watt 1% Resistor 5.6K Ohm 1/8 Watt 1% Resistor 10.0K Ohm 1/8 Watt 1% Resistor 22.0K Ohm 1/8 Watt 1% Resistor 33.0K Ohm 1/8 Watt 1% Resistor 100K Ohm 1/8 Watt 1% Resistor 1206 - 1206 Surface Mount Package 2012 - 2010 Surface Mount Package 0.11 Ohm 1/2 Watt 1% Resistor - Digikey: RHM.11UCT-ND
R16 R23 = pot:TRIM_US-: POTENTIOMETER
R45 R46 RFBB1 RFBB2 = AcceleratedDesigns_Lib:CRCW0402137KFKED; MANUFACTURER_NAME: Vishay-Dale; MANUFACTURER_PART_NUMBER: CRCW0402137KFKED; POWER: 0.063; RESISTANCE: 137000.0; TOLERANCE: 1.0; VENDOR: Vishay-Dale
RFBT1 = AcceleratedDesigns_Lib:CRCW0402768KFKED; MANUFACTURER_NAME: Vishay-Dale; MANUFACTURER_PART_NUMBER: CRCW0402768KFKED; POWER: 0.063; RESISTANCE: 768000.0; TOLERANCE: 1.0; VENDOR: Vishay-Dale
RFBT2 = AcceleratedDesigns_Lib:RT0805BRD071M26L; MANUFACTURER_NAME: Yageo America; MANUFACTURER_PART_NUMBER: RT0805BRD071M26L; POWER: 0.125; RESISTANCE: 1260000.0; TOLERANCE: 0.1; VENDOR: Yageo America
S1 = switch-omron:10-XX: OMRON SWITCH; MPN: B3F-1000; OC_FARNELL: 176432; OC_NEWARK: 36M3542
TP1 TP4 TP5 = SparkFun-Passives:TEST-POINT: Bare copper test points for troubleshooting or ICT
U1 = texas:CC3200MOD: The CC3200MOD is a Wi-Fi Module that Consists of the CC3200R1M2RGC Single-Chip Wireless MCU. This Fully Integrated Module Includes all Required Clocks, SPI Flash, and Passives. More information can be found at: http://www.ti.com/product/CC3200MOD/description.
U2 = texas:HDC1080: The HDC1080 is a low power digital humidity sensor with integrated temperature sensor with excellent measurement accuracy . It operates over a wide supply range, and is a low cost, low power alternative to competitive solutions in a wide range of common applications. The humidity and temperature sensors are factory calibrated.
U3 = texas:OPT3001: The OPT3001 is a single-chip lux meter, measuring the intensity of light as visible by the human eye.
U4 = microbuilder:GPS_FGPMMOPA6H: GPS Module - MTK MT3339 Chipset, -165dBm sensitivity, 22 channels, 10Hz, auto-select external antenna options
U5 = SparkFun-Sensors:MICS-4514: Metal oxide MEMS carbon monoxide (CO) and NOx sensor in an SMD package.; PROD_ID: COMP-12310
U6 = texas:ADS1015
U7 U8 = AcceleratedDesigns_Lib:TPS63020DSJR; DATASHEETURL: http://www.ti.com/lit/ds/symlink/tps63020.pdf; FREQUENCY: 2400000.0; IMAX: 3.0; MANUFACTURER_NAME: Texas Instruments; MANUFACTURER_PART_NUMBER: TPS63020DSJR; MKTG_PACKAGE: TPS63020; NSID: TPS63020DSJR; PACKAGE: TPS63020; VENDOR: Texas Instruments
U9 = texas:TLV2333